# Altium project SAMD21_Base.PrjPcb
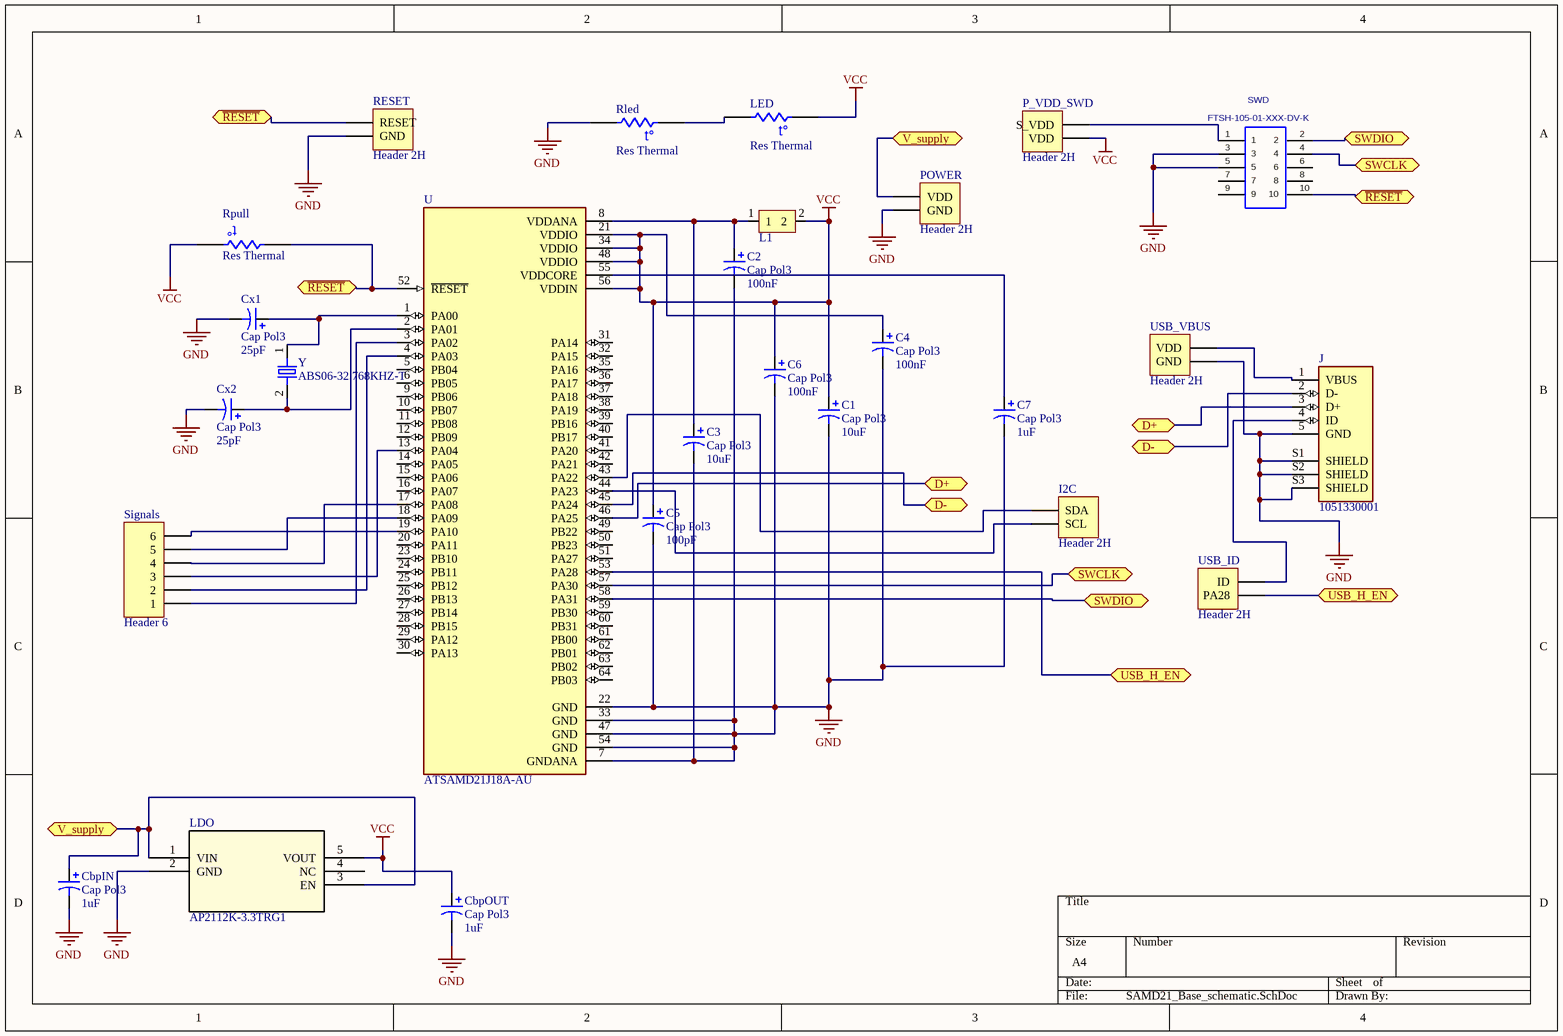
[diagram p0: SAMD21_Base_schematic.SchDoc]
1 sheet, 27 parts. Net scope: flat (ports and power ports of the same name join across sheets).
Board file: SAMD21_Base_Layout.PcbDoc

## Sheet SAMD21_Base_schematic.SchDoc
size A4

### Parts
C1  Cap Pol3  value 10uF  [C0805]
C2  Cap Pol3  value 100nF  [C0805]
C3  Cap Pol3  value 10uF  [C0805]
C4  Cap Pol3  value 100nF  [C0805]
C5  Cap Pol3  value 100pF  [C0805]
C6  Cap Pol3  value 100nF  [C0805]
C7  Cap Pol3  value 1uF  [C0805]
CbpIN  Cap Pol3  value 1uF  [C0805]
CbpOUT  Cap Pol3  value 1uF  [C0805]
Cx1  Cap Pol3  value 25pF  [C0805]
Cx2  Cap Pol3  value 25pF  [C0805]
I2C  Header 2H  [HDR1X2H]
J  1051330001  [MOLEX_1051330001]
L1  SRP4012TA-100M  [Inductor]  (value not drawn)
LDO  AP2112K-3.3TRG1  [SOT_RG1_DIO]
LED  Res Thermal  [6-0805_N]
P_VDD_SWD  Header 2H  [HDR1X2H]
POWER  Header 2H  [HDR1X2H]
RESET  Header 2H  [HDR1X2H]
Rled  Res Thermal  [6-0805_N]
Rpull  Res Thermal  [6-0805_N]
Signals  Header 6  [HDR1X6]
SWD  FTSH-105-01-XXX-DV-K  [FTSH-105-01-XXX-DV-K]
U  ATSAMD21J18A-AU  [QFP80P1600X1600X120-64N]
USB_ID  Header 2H  [HDR1X2H]
USB_VBUS  Header 2H  [HDR1X2H]
Y  ABS06-32.768KHZ-T  [XTAL_ABS06-32.768KHZ-T]

### Ports
D+ (bidir), D- (bidir), SWCLK (bidir), SWDIO (bidir), USB_H_EN (bidir), V_supply (bidir), ~{RESET} (bidir)

### Nets
GND: C1.2 C2.2 C3.2 C4.2 C5.2 C6.2 C7.2 CbpIN.2 CbpOUT.2 Cx1.2 Cx2.2 J.5(GND) J.S1(SHIELD) J.S2(SHIELD) J.S3(SHIELD) LDO.2(GND) POWER.2(GND) RESET.2(GND) Rled.2 SWD.3 SWD.5 U.7(GNDANA) U.22(GND) U.33(GND) U.47(GND) U.54(GND) USB_VBUS.1(GND)
VCC: C1.1 C4.1 C5.1 C6.1 CbpOUT.1 L1.2 LDO.5(VOUT) LED.1 P_VDD_SWD.1(VDD) Rpull.1 U.21(VDDIO) U.34(VDDIO) U.48(VDDIO) U.56(VDDIN)
NetC2_1: C2.1 C3.1 L1.1 U.8(VDDANA)
NetC7_1: C7.1 U.55(VDDCORE)
NetCbpIN_1: CbpIN.1 LDO.1(VIN) LDO.3(EN) POWER.1(VDD) ; port V_supply
NetCx1_1: Cx1.1 U.1(PA00) Y.1
NetCx2_1: Cx2.1 U.2(PA01) Y.2
NetI2C_1: I2C.1(SDA) U.43(PA22)
NetI2C_2: I2C.2(SCL) U.44(PA23)
NetJ_1: J.1(VBUS) USB_VBUS.2(VDD)
NetJ_2: J.2(D-) U.45(PA24) ; port D-
NetJ_3: J.3(D+) U.46(PA25) ; port D+
NetJ_4: J.4(ID) USB_ID.2(ID)
NetLED_2: LED.2 Rled.1
NetP_VDD_SWD_2: P_VDD_SWD.2(S_VDD) SWD.1
NetRESET_1: RESET.1(RESET) Rpull.2 SWD.10 U.52(~{RESET}) ; port ~{RESET}
NetSignals_1: Signals.1 U.3(PA02)
NetSignals_2: Signals.2 U.4(PA03)
NetSignals_3: Signals.3 U.13(PA04)
NetSignals_4: Signals.4 U.17(PA08)
NetSignals_5: Signals.5 U.18(PA09)
NetSignals_6: Signals.6 U.19(PA10)
NetSWD_2: SWD.2 U.58(PA31) ; port SWDIO
NetSWD_4: SWD.4 U.57(PA30) ; port SWCLK
NetU_53: U.53(PA28) USB_ID.1(PA28) ; port USB_H_EN

Not connected (* = marked no-connect by the designer): LDO 4(NC); SWD 6 7 8 9; U 5(PB04) 6(PB05) 9(PB06) 10(PB07) 11(PB08) 12(PB09) 14(PA05) 15(PA06) 16(PA07) 20(PA11) 23(PB10) 24(PB11) 25(PB12) 26(PB13) 27(PB14) 28(PB15) 29(PA12) 30(PA13) 31(PA14) 32(PA15) 35(PA16) 36(PA17) 37(PA18) 38(PA19) 39(PB16) 40(PB17) 41(PA20) 42(PA21) 49(PB22) 50(PB23) 51(PA27) 59(PB30) 60(PB31) 61(PB00) 62(PB01) 63(PB02) 64(PB03)

### Notes on the sheet
- (in symbol Res Thermal) t°

### Library data of the parts
C1-C7 CbpIN CbpOUT Cx1 Cx2 = Cap Pol3: Polarized Capacitor (Surface Mount); Published: 8-Jun-2000; LatestRevisionDate: 29-May-2009; LatestRevisionNote: IPC-7351 Footprint Added.; PackageReference: C0805; Publisher: Altium Limited; PackageDescription: Chip Capacitor
I2C P_VDD_SWD POWER RESET USB_ID USB_VBUS = Header 2H: Header, 2-Pin, Right Angle; LatestRevisionDate: 17-Jul-2002; LatestRevisionNote: Re-released for DXP Platform.; Publisher: Altium Limited
J = 1051330001: USB Connectors MICRO USB B RECPT VERTICAL; MP: 105133-0001; MF: Molex; Availability: Unavailable; SnapEDA_Link: https://www.snapeda.com/parts/105133-0001/Molex/view-part/4775133/?ref=snap; Price: None; Package: None; Value: *
L1 = SRP4012TA-100M: Inductor
LDO = AP2112K-3.3TRG1: No Description Available; Vendor: Diodes Inc; Built_By: EMA_Matt; SourceLibrary: Diodes_Inc_2019-12-05; Manufacturer_Part_Number: AP2112K-3.3TRG1; Copyright: Copyright (C) 2018 Accelerated Designs. All rights reserved; RefDes: RefDes; Type: DEV
LED Rled Rpull = Res Thermal: Thermistor; Published: 24-Mar-1999; LatestRevisionDate: 29-May-2009; LatestRevisionNote: IPC-7351 Footprint Added.; PackageVersion: Mar-2003; PackageReference: 6-0805; Publisher: Altium Limited; PackageDescription: Chip Resistor 0805 Case Size; Code_IPC: RESC2012
Signals = Header 6: Header, 6-Pin; LatestRevisionDate: 17-Jul-2002; LatestRevisionNote: Re-released for DXP Platform.; Publisher: Altium Limited
SWD = FTSH-105-01-XXX-DV-K: TERMINAL STRIP, .050"(1.27mm) PITCH, 10 PINS, KEYED; MANUFACTURER: SAMTEC; CREATED: November 30, 2016 - Wendy Xin; PCB DECAL: FTSH-105-01-XXX-DV-K
U = ATSAMD21J18A-AU: ARMÂ® CortexÂ®-M0+ SAM D21J Microcontroller IC 32-Bit 48MHz 256KB _256K x 8_ FLASH 64-TQFP _10x10_; MF: Microchip; Price: None; Value: *; Package: TQFP-64 Microchip; Availability: Unavailable; SnapEDA_Link: https://www.snapeda.com/parts/ATSAMD21J18A-AU/Microchip/view-part/588919/?ref=snap; MP: ATSAMD21J18A-AU
Y = ABS06-32.768KHZ-T: 32.768kHz Â±20ppm Crystal 12.5pF 90 kOhms 2-SMD, No Lead; MF: Abracon; SnapEDA_Link: https://www.snapeda.com/parts/ABS06-32.768KHZ-T/Abracon%20LLC/view-part/108994/?ref=snap; DigiKey-Purchase-URL: https://snapeda.com/shop?store=DigiKey&id=108994; MP: ABS06-32.768KHZ-T; Availability: Unavailable; Price: None; Value: *; Package: SMD-2 Abracon